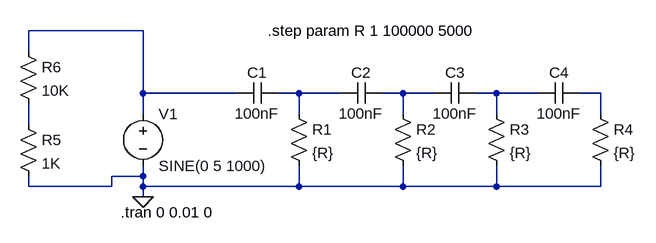
[diagram p0: schematic phase_shift_rc_chain.asc]
phase_shift_rc_chain.asc, the LTspice schematic file:
Version 4
SHEET 1 880 680
WIRE -16 32 -192 32
WIRE -192 64 -192 32
WIRE -16 128 -16 32
WIRE 128 128 -16 128
WIRE 224 128 192 128
WIRE 288 128 224 128
WIRE 384 128 352 128
WIRE 432 128 384 128
WIRE 528 128 496 128
WIRE 592 128 528 128
WIRE 688 128 656 128
WIRE -16 160 -16 128
WIRE 224 160 224 128
WIRE 384 160 384 128
WIRE 528 160 528 128
WIRE 688 160 688 128
WIRE -192 176 -192 144
WIRE -16 256 -16 240
WIRE -16 256 -64 256
WIRE -192 272 -192 256
WIRE -64 272 -64 256
WIRE -64 272 -192 272
WIRE -16 272 -16 256
WIRE 224 272 224 240
WIRE 224 272 -16 272
WIRE 384 272 384 240
WIRE 384 272 224 272
WIRE 528 272 528 240
WIRE 528 272 384 272
WIRE 688 272 688 240
WIRE 688 272 528 272
WIRE -16 288 -16 272
FLAG -16 288 0
SYMBOL voltage -16 144 R0
WINDOW 123 0 0 Left 2
WINDOW 39 0 0 Left 2
SYMATTR InstName V1
SYMATTR Value SINE(0 5 1000)
SYMBOL res 208 144 R0
SYMATTR InstName R1
SYMATTR Value {R}
SYMBOL cap 192 112 R90
WINDOW 0 0 32 VBottom 2
WINDOW 3 32 32 VTop 2
SYMATTR InstName C1
SYMATTR Value 100nF
SYMBOL res 368 144 R0
SYMATTR InstName R2
SYMATTR Value {R}
SYMBOL cap 352 112 R90
WINDOW 0 0 32 VBottom 2
WINDOW 3 32 32 VTop 2
SYMATTR InstName C2
SYMATTR Value 100nF
SYMBOL res 512 144 R0
SYMATTR InstName R3
SYMATTR Value {R}
SYMBOL cap 496 112 R90
WINDOW 0 0 32 VBottom 2
WINDOW 3 32 32 VTop 2
SYMATTR InstName C3
SYMATTR Value 100nF
SYMBOL res 672 144 R0
SYMATTR InstName R4
SYMATTR Value {R}
SYMBOL cap 656 112 R90
WINDOW 0 0 32 VBottom 2
WINDOW 3 32 32 VTop 2
SYMATTR InstName C4
SYMATTR Value 100nF
SYMBOL res -208 160 R0
SYMATTR InstName R5
SYMATTR Value 1K
SYMBOL res -208 48 R0
SYMATTR InstName R6
SYMATTR Value 10K
TEXT -50 312 Left 2 !.tran 0 0.01 0
TEXT 176 32 Left 2 !.step param R 1 100000 5000

The netlist it stands for:
* phase_shift_rc_chain.asc
V1 N001 0 SINE(0 5 1000)
R1 N002 0 {R}
C1 N002 N001 100nF
R2 N003 0 {R}
C2 N003 N002 100nF
R3 N004 0 {R}
C3 N004 N003 100nF
R4 N005 0 {R}
C4 N005 N004 100nF
R5 N006 0 1K
R6 N001 N006 10K
.tran 0 0.01 0
.step param R 1 100000 5000
.backanno
.end